# Altium schematic sheet relay_latch_circuit_v2.SchDoc
size A4
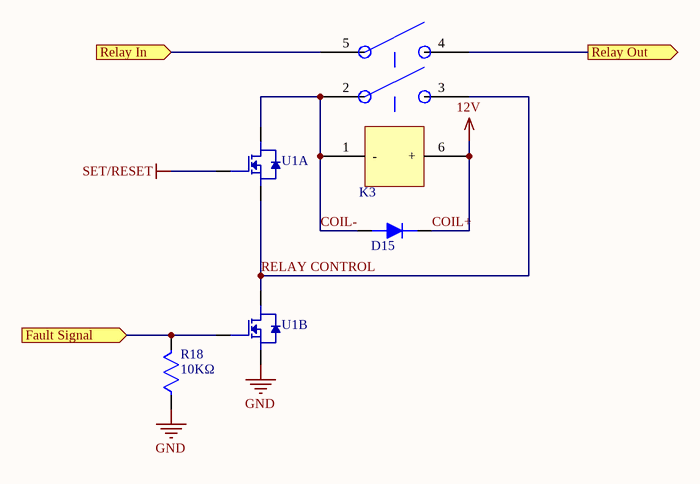
[diagram p0: relay_latch_circuit_v2.SchDoc]

## Parts
D15  SD560BTR  [DIODE]  (value not drawn)
K3  5-1419124-6  [DPST SDC RELAY]  (value not drawn)
R18  10KΩ  [RESISTOR CRCW0603]
U1  SSM6N7002CFU,LF  [N-MOSFET (2 FETS)]  (value not drawn)  (parts A,B of 2)

## Ports
Fault Signal (in), Relay In (in), Relay Out (out)

## Nets
COIL+: D15.2 K3.6(+)  [also labelled 12V]
GND: R18.1 U1.4(S2)
SET/RESET: U1.2(G1)
COIL-: D15.1 K3.1(-) K3.2 U1.6(D1)
Fault Signal: R18.2 U1.5(G2) ; port Fault Signal
RELAY CONTROL: K3.3 U1.1(S1) U1.3(D2)
Relay In: K3.5 ; port Relay In
Relay Out: K3.4 ; port Relay Out

## Library data of the parts
D15 = SD560BTR: DIODE GEN PURP 600V 5A SMB; Manufacturer: SMC; Supplier 1: Digi-Key; Manufacturer Part Number: SD560BTR; Stock 1: 90144; Pricing 1: 1=0.42, 10=0.309, 100=0.1468, 500=0.11978, 1000=0.08887 (USD); Mount: Surface Mount; Packaging: Tape and Reel; Max Reverse Voltage (DC): 600V; ComponentLink1URL: http://www.smc-diodes.com/propdf/SD560B%20N1412%20REV.D.pdf?src-supplier=Digi-Key; ComponentLink1Description: http://www.smc-diodes.com/propdf/SD560B%20N1412%20REV.D.pdf?src-supplier=Digi-Key; Supplier Part Number 1: 1655-1530-6-ND; Category: Discrete Semiconductor Products; Average Rectified Current: 5A; Case/Package: SMB
K3 = 5-1419124-6: General Purpose Relay, Osa Series, Power, Non Latching, Dpst-No, 12 Vdc, 3 A Rohs Compliant: Yes; Manufacturer: TE Connectivity; Contact Current Rating: 3A; Coil Current: 45mA; Throw Configuration: DPST; Operate Time: 20ms; Release Time: 10ms; Coil Power: 600mW; Coil Resistance: 270R; Coil Type: Non-Latching; Coil Voltage (DC): 12V; Contact Voltage Rating (AC): 240V; Supplier 1: Digi-Key; Manufacturer Part Number: 5-1419124-6; Stock 1: 2593; Pricing 1: 1=2.54, 10=2.385, 25=2.1204, 50=2.0142, 100=1.9083, 250=1.69624, 500=1.59022, 1000=1.48421, 5000=1.4312 (USD); Mount: Through Hole; Weight: 13g; Contact Material: Silver; Min Operating Temperature: -30°C; Max Operating Temperature: 60°C; Package Quantity: 1000; Packaging: Box; Termination: PCB; Relay Type: General Purpose; Length: 24.4mm; Height: 0.976inch; Width: 12.9mm; ELV: Compliant; REACH SVHC: Unknown; ComponentLink1URL: http://www.farnell.com/datasheets/1652820.pdf?src-supplier=Farnell; ComponentLink1Description: http://www.farnell.com/datasheets/1652820.pdf?src-supplier=Farnell; ComponentLink2URL: http://www.farnell.com/cad/1652820.pdf?src-supplier=Element14; ComponentLink2Description: http://www.farnell.com/cad/1652820.pdf?src-supplier=Element14; ComponentLink3URL: http://www.te.com/commerce/DocumentDelivery/DDEController?Action=srchrtrv&DocNm=5-1419124-6&DocType=Customer+Drawing&DocLang=English&src-supplier=Digi-Key; ComponentLink3Description: http://www.te.com/commerce/DocumentDelivery/DDEController?Action=srchrtrv&DocNm=5-1419124-6&DocType=Customer+Drawing&DocLang=English&src-supplier=Digi-Key; Supplier Part Number 1: OSA-SS-212DM3,000-ND; Category: Relays
R18 = CRCW060310K0FKEA: RES SMD 10K OHM 1% 1/10W 0603; Manufacturer: Vishay; Resistance: 10kR; Temperature Coefficient: 100ppm/°C; Power Rating: 100mW; Voltage Rating: 75V; Supplier 1: Digi-Key; Manufacturer Part Number: CRCW060310K0FKEA; Stock 1: 1434373; Pricing 1: 1=0.1, 10=0.034, 100=0.0139, 1000=0.00623, 2500=0.0054 (USD); Case/Package: 0603; Number of Pins: 2; Weight: 7.1E-05oz; Contact Plating: Tin,Lead; Case Code (Metric): 1608; Case Code (Imperial): 0603; Min Operating Temperature: -55°C; Max Operating Temperature: 155°C; Tolerance: 1%; Composition: Thick Film; Packaging: Tape and Reel; Package Quantity: 10; Number of Terminations: 2; Military Standard: Not; Termination: SMD/SMT; Max Power Dissipation: 100mW; Voltage Rating (DC): 75V; Features: Automotive AEC-Q200; Length: 1.55mm; Height: 0.45mm; Width: 0.033inch; Depth: 0.85mm; Radiation Hardening: No; Lead Free: Lead Free; REACH SVHC: Unknown; ComponentLink1URL: http://www.vishay.com/docs/20008/dcrcw.pdf?src-supplier=Avnet+Europe; ComponentLink1Description: http://www.vishay.com/docs/20008/dcrcw.pdf?src-supplier=Avnet+Europe; ComponentLink2URL: https://www.verical.com/server-webapp/html/getDatasheet?partID=86831&src-supplier=Verical; ComponentLink2Description: https://www.verical.com/server-webapp/html/getDatasheet?partID=86831&src-supplier=Verical; ComponentLink3URL: http://www.farnell.com/datasheets/2310790.pdf?src-supplier=Allied+Electronics; ComponentLink3Description: http://www.farnell.com/datasheets/2310790.pdf?src-supplier=Allied+Electronics; ComponentLink4URL: http://www.vishay.com/docs/20035/dcrcwe3.pdf?src-supplier=Digi-Key; ComponentLink4Description: http://www.vishay.com/docs/20035/dcrcwe3.pdf?src-supplier=Digi-Key; ComponentLink5URL: http://www.farnell.com/datasheets/2310790.pdf?src-supplier=Mouser; ComponentLink5Description: http://www.farnell.com/datasheets/2310790.pdf?src-supplier=Mouser; ComponentLink6URL: http://www.farnell.com/datasheets/2310790.pdf?src-supplier=Element14; ComponentLink6Description: http://www.farnell.com/datasheets/2310790.pdf?src-supplier=Element14; ComponentLink7URL: http://www.farnell.com/datasheets/2310790.pdf?src-supplier=Avnet; ComponentLink7Description: http://www.farnell.com/datasheets/2310790.pdf?src-supplier=Avnet; ComponentLink8URL: http://www.vishay.com/docs/20035/dcrcwe3.pdf?src-supplier=Future+Electronics; ComponentLink8Description: http://www.vishay.com/docs/20035/dcrcwe3.pdf?src-supplier=Future+Electronics; ComponentLink9URL: http://uk.rs-online.com/webdocs/0d98/0900766b80d98afc.pdf?src-supplier=RSComponents; ComponentLink9Description: http://uk.rs-online.com/webdocs/0d98/0900766b80d98afc.pdf?src-supplier=RSComponents; ComponentLink10URL: http://www.farnell.com/datasheets/2310790.pdf?src-supplier=Distrelec; ComponentLink10Description: http://www.farnell.com/datasheets/2310790.pdf?src-supplier=Distrelec; Supplier Part Number 1: 541-10.0KHCT-ND; Category: Resistors
U1 = SSM6N7002CFU,LF: MOSFET 2N-CH 60V 0.17A US6; Manufacturer: Toshiba; Continuous Drain Current (ID): 170mA; Rds On Max: 3.9R; Input Capacitance: 17pF; Max Power Dissipation: 285mW; FET Type: 2 N-Channel; Supplier 1: Digi-Key; Manufacturer Part Number: SSM6N7002CFU,LF; Stock 1: 13946; Pricing 1: 1=0.27, 10=0.221, 100=0.0906, 500=0.0756, 1000=0.05253 (USD); Mount: Surface Mount; Case/Package: SOT-363; Packaging: Tape and Reel; Drain to Source Voltage (Vdss): 60V; ComponentLink1URL: https://toshiba.semicon-storage.com/info/docget.jsp?did=29875&prodName=SSM6N7002CFU&src-supplier=Digi-Key; ComponentLink1Description: https://toshiba.semicon-storage.com/info/docget.jsp?did=29875&prodName=SSM6N7002CFU&src-supplier=Digi-Key; ComponentLink2URL: http://www.mouser.com/ds/2/408/SSM6N7002CFU_datasheet_en_20150413-736631.pdf?src-supplier=Mouser; ComponentLink2Description: http://www.mouser.com/ds/2/408/SSM6N7002CFU_datasheet_en_20150413-736631.pdf?src-supplier=Mouser; Category: Discrete Semiconductor Products; Supplier Part Number 1: SSM6N7002CFULFDKR-ND